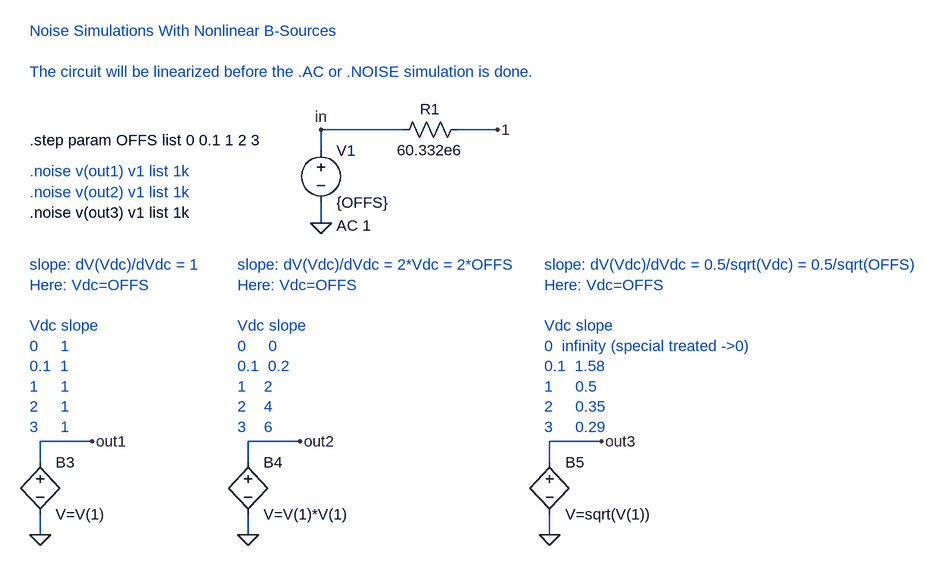
[diagram p0: schematic Nonlinear_devices_NOISE_AC_1.asc]
Nonlinear_devices_NOISE_AC_1.asc, the LTspice schematic file:
Version 4
SHEET 1 1488 708
WIRE 624 64 496 64
WIRE 768 64 704 64
WIRE 496 96 496 64
WIRE 496 208 496 176
WIRE 144 544 64 544
WIRE 464 544 384 544
WIRE 928 544 848 544
WIRE 64 576 64 544
WIRE 384 576 384 544
WIRE 848 576 848 544
WIRE 64 688 64 656
WIRE 384 688 384 656
WIRE 848 688 848 656
FLAG 496 208 0
FLAG 496 64 in
FLAG 768 64 1
FLAG 64 688 0
FLAG 384 688 0
FLAG 144 544 out1
FLAG 464 544 out2
FLAG 848 688 0
FLAG 928 544 out3
SYMBOL voltage 496 80 R0
WINDOW 123 24 132 Left 0
WINDOW 39 0 0 Left 0
SYMATTR Value2 AC 1
SYMATTR InstName V1
SYMATTR Value {OFFS}
SYMBOL res 608 80 R270
WINDOW 0 32 56 VTop 0
WINDOW 3 0 56 VBottom 0
SYMATTR InstName R1
SYMATTR Value 60.332e6
SYMBOL bv 64 560 R0
SYMATTR InstName B3
SYMATTR Value V=V(1)
SYMBOL bv 384 560 R0
SYMATTR InstName B4
SYMATTR Value V=V(1)*V(1)
SYMBOL bv 848 560 R0
SYMATTR InstName B5
SYMATTR Value V=sqrt(V(1))
TEXT 48 80 Left 0 !.step param OFFS list 0 0.1 1 2 3
TEXT 48 128 Left 0 ;.noise v(out1) v1 list 1k
TEXT 48 160 Left 0 ;.noise v(out2) v1 list 1k
TEXT 48 -88 Left 0 ;Noise Simulations With Nonlinear B-Sources\n \nThe circuit will be linearized before the .AC or .NOISE simulation is done.
TEXT 368 272 Left 0 ;slope: dV(Vdc)/dVdc = 2*Vdc = 2*OFFS\nHere: Vdc=OFFS\n \nVdc slope\n0     0\n0.1  0.2\n1    2\n2    4\n3    6
TEXT 48 272 Left 0 ;slope: dV(Vdc)/dVdc = 1 \nHere: Vdc=OFFS\n \nVdc slope\n0     1\n0.1  1\n1     1\n2     1\n3     1
TEXT 840 272 Left 0 ;slope: dV(Vdc)/dVdc = 0.5/sqrt(Vdc) = 0.5/sqrt(OFFS)\nHere: Vdc=OFFS\n \nVdc slope\n0  infinity (special treated ->0)\n0.1  1.58\n1     0.5\n2     0.35\n3     0.29
TEXT 48 192 Left 0 !.noise v(out3) v1 list 1k

The netlist it stands for:
* Nonlinear_devices_NOISE_AC_1.asc
V1 in 0 {OFFS} AC 1
R1 in 1 60.332e6
B3 out1 0 V=V(1)
B4 out2 0 V=V(1)*V(1)
B5 out3 0 V=sqrt(V(1))
.step param OFFS list 0 0.1 1 2 3
* .noise v(out1) v1 list 1k
* .noise v(out2) v1 list 1k
* Noise Simulations With Nonlinear B-Sources
* The circuit will be linearized before the .AC or .NOISE simulation is done.
* slope: dV(Vdc)/dVdc = 2*Vdc = 2*OFFS
* Here: Vdc=OFFS
* Vdc slope
* 0     0
* 0.1  0.2
* 1    2
* 2    4
* 3    6
* slope: dV(Vdc)/dVdc = 1
* Here: Vdc=OFFS
* Vdc slope
* 0     1
* 0.1  1
* 1     1
* 2     1
* 3     1
* slope: dV(Vdc)/dVdc = 0.5/sqrt(Vdc) = 0.5/sqrt(OFFS)
* Here: Vdc=OFFS
* Vdc slope
* 0  infinity (special treated ->0)
* 0.1  1.58
* 1     0.5
* 2     0.35
* 3     0.29
.noise v(out3) v1 list 1k
.backanno
.end